# Altium schematic sheet FPGA_165B_Repeat_DigitalIO_Base.SchDoc: LiveDesign Evaluation - Repeat Digital IO
size A; Organization: Altium Limited; Address1: L3, 12a Rodborough Rd; Address2: Frenchs Forest; Address3: NSW; Address4: Australia 2086; DocumentNumber: 2; SheetNumber: 2; SheetTotal: 2
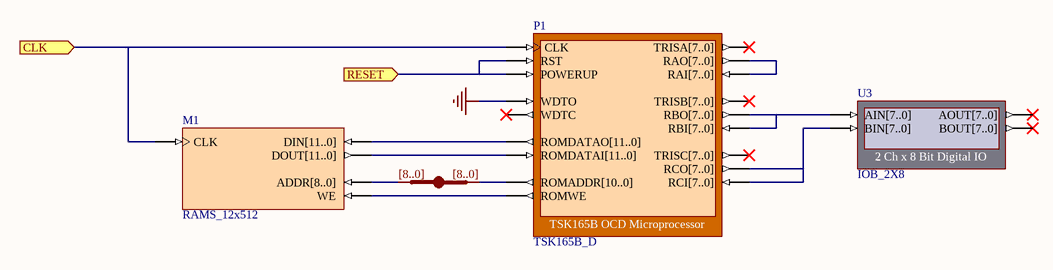
[diagram p0: FPGA_165B_Repeat_DigitalIO_Base.SchDoc]

## Parts
JB_S1  IndexA: [8..0]  (hidden comment: JB)
M1  RAMS_12x512
P1  TSK165B_D
U3  IOB_2X8

## Ports
CLK (in), RESET (in)

## Nets
GND: P1.WDTO
CLK: M1.CLK P1.CLK ; port CLK
RESET: P1.POWERUP P1.RST ; port RESET
NetJB_S1_A[0..0]: JB_S1.A[0..0] P1.ROMADDR[10..0]
NetJB_S1_B[0..0]: JB_S1.B[0..0] M1.ADDR[8..0]
NetM1_DIN[11..0]: M1.DIN[11..0] P1.ROMDATAO[11..0]
NetM1_DOUT[11..0]: M1.DOUT[11..0] P1.ROMDATAI[11..0]
NetM1_WE: M1.WE P1.ROMWE
NetP1_RAI[7..0]: P1.RAI[7..0] P1.RAO[7..0]
NetP1_RBI[7..0]: P1.RBI[7..0] P1.RBO[7..0] U3.AIN[7..0]
NetP1_RCI[7..0]: P1.RCI[7..0] P1.RCO[7..0] U3.BIN[7..0]

Not connected (* = marked no-connect by the designer): P1 TRISA[7..0]* TRISB[7..0]* TRISC[7..0]* WDTC*; U3 AOUT[7..0]* BOUT[7..0]*

## Notes on the sheet
- Title
- Size:
- Date:
- A
- Number:
- Time:
- Revision:
- Sheet
- of
- File:

## Library data of the parts
JB_S1 = JB: System BUS Joiner; Published: 29-Jan-2004; Publisher: Altium Limited; Core Revision: 1.00.00; IndexB: [8..0]
M1 = RAMS_12x512: Single Port RAM; Memory_Depth: 512; Memory_Type: RAM_SinglePortBlock; Memory_Width: 12; Memory_ClockEdge: Rising; Nexus_Core: Memory_Program; Memory_EnablePin: False; Published: 23/04/2004; Publisher: Altium Hobart Technology Center
P1 = TSK165B_D: TSK165B OCD Microprocessor; NEXUS_CORE: Processor_OCDS; NEXUS_JTAG_DEVICE: True; NEXUS_JTAG_ORDER: 0; ChildModel1: TSK165B_D_RAM128x8; ChildCore1: M1; Published: 18/12/2003; Publisher: Altium Hobart Technology Centre; Core Revision: 1.00.00
U3 = IOB_2X8: 2 Ch x 8 Bit Digital IO; NEXUS_CORE: Instrument; NEXUS_JTAG_DEVICE: True; NEXUS_JTAG_ORDER: 0; Published: 30/09/2003; Publisher: Altium Hobart Technology Centre; Core Revision: 1.00.00